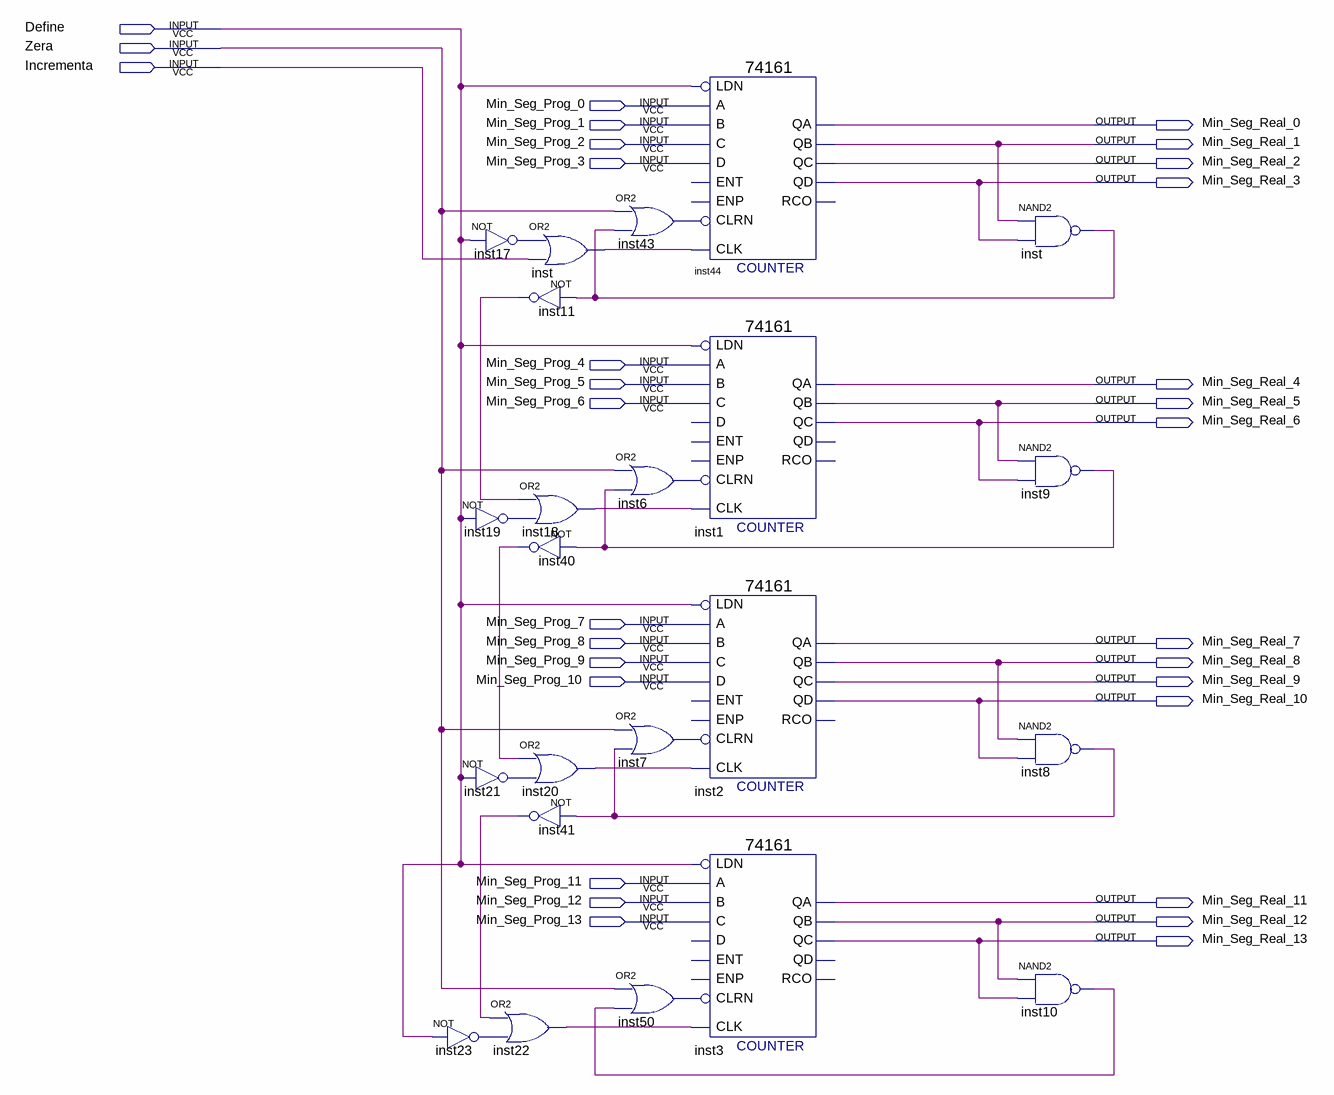
[diagram p0: schematic sheet]
// Quartus schematic FD_relogio.bdf as structural Verilog: 23 symbols, 31 pins
module FD_relogio (
  input  Define,
  input  Zera,
  input  Incrementa,
  input  Min_Seg_Prog_0,
  input  Min_Seg_Prog_1,
  input  Min_Seg_Prog_2,
  input  Min_Seg_Prog_3,
  input  Min_Seg_Prog_4,
  input  Min_Seg_Prog_5,
  input  Min_Seg_Prog_6,
  input  Min_Seg_Prog_7,
  input  Min_Seg_Prog_8,
  input  Min_Seg_Prog_9,
  input  Min_Seg_Prog_10,
  input  Min_Seg_Prog_11,
  input  Min_Seg_Prog_12,
  input  Min_Seg_Prog_13,
  output Min_Seg_Real_0,
  output Min_Seg_Real_1,
  output Min_Seg_Real_2,
  output Min_Seg_Real_3,
  output Min_Seg_Real_4,
  output Min_Seg_Real_5,
  output Min_Seg_Real_6,
  output Min_Seg_Real_7,
  output Min_Seg_Real_8,
  output Min_Seg_Real_9,
  output Min_Seg_Real_10,
  output Min_Seg_Real_11,
  output Min_Seg_Real_12,
  output Min_Seg_Real_13
);

  wire inst6_out, inst7_out, inst8_out, inst9_out, inst10_out, inst11_out, inst17_out, inst18_out,
       inst19_out, inst20_out, inst21_out, inst22_out, inst23_out, inst40_out, inst41_out, inst43_out,
       inst50_out, inst_out, inst_out_2;

  not inst17 (inst17_out, Define);
  not inst19 (inst19_out, Define);
  not inst21 (inst21_out, Define);
  not inst23 (inst23_out, Define);
  or inst (inst_out_2, inst17_out, Incrementa);
  not inst11 (inst11_out, inst_out);
  or inst18 (inst18_out, inst11_out, inst19_out);
  not inst40 (inst40_out, inst9_out);
  or inst20 (inst20_out, inst40_out, inst21_out);
  not inst41 (inst41_out, inst8_out);
  or inst22 (inst22_out, inst41_out, inst23_out);
  or inst43 (inst43_out, Zera, inst_out);
  or inst6 (inst6_out, Zera, inst9_out);
  or inst7 (inst7_out, Zera, inst8_out);
  or inst50 (inst50_out, Zera, inst10_out);
  \74161  inst44 (
    .CLRN(inst43_out), .CLK(inst_out_2), .LDN(Define), .A(Min_Seg_Prog_0), .D(Min_Seg_Prog_3),
    .B(Min_Seg_Prog_1), .C(Min_Seg_Prog_2), .QD(Min_Seg_Real_3), .QC(Min_Seg_Real_2), .QB(Min_Seg_Real_1),
    .QA(Min_Seg_Real_0));  // open: ENP, ENT, RCO
  \74161  inst1 (
    .CLRN(inst6_out), .CLK(inst18_out), .LDN(Define), .A(Min_Seg_Prog_4), .B(Min_Seg_Prog_5),
    .C(Min_Seg_Prog_6), .QC(Min_Seg_Real_6), .QB(Min_Seg_Real_5), .QA(Min_Seg_Real_4));  // open: ENP, D, ENT, QD, RCO
  \74161  inst2 (
    .CLRN(inst7_out), .CLK(inst20_out), .LDN(Define), .A(Min_Seg_Prog_7), .D(Min_Seg_Prog_10),
    .B(Min_Seg_Prog_8), .C(Min_Seg_Prog_9), .QD(Min_Seg_Real_10), .QC(Min_Seg_Real_9), .QB(Min_Seg_Real_8),
    .QA(Min_Seg_Real_7));  // open: ENP, ENT, RCO
  \74161  inst3 (
    .CLRN(inst50_out), .CLK(inst22_out), .LDN(Define), .A(Min_Seg_Prog_11), .B(Min_Seg_Prog_12),
    .C(Min_Seg_Prog_13), .QC(Min_Seg_Real_13), .QB(Min_Seg_Real_12), .QA(Min_Seg_Real_11));  // open: ENP, D, ENT, QD, RCO
  nand inst_dup2 (inst_out, Min_Seg_Real_1, Min_Seg_Real_3);
  nand inst9 (inst9_out, Min_Seg_Real_5, Min_Seg_Real_6);
  nand inst8 (inst8_out, Min_Seg_Real_8, Min_Seg_Real_10);
  nand inst10 (inst10_out, Min_Seg_Real_12, Min_Seg_Real_13);
endmodule
